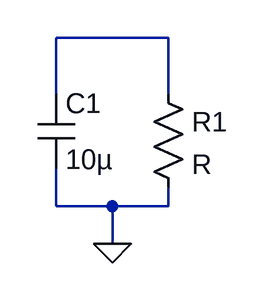
[diagram p0: schematic Draft2.asc]
Draft2.asc, the LTspice schematic file:
Version 4
SHEET 1 880 680
WIRE 240 96 144 96
WIRE 144 144 144 96
WIRE 240 144 240 96
WIRE 144 240 144 208
WIRE 192 240 144 240
WIRE 240 240 240 224
WIRE 240 240 192 240
WIRE 192 272 192 240
FLAG 192 272 0
SYMBOL res 224 128 R0
SYMATTR InstName R1
SYMBOL cap 128 144 R0
SYMATTR InstName C1
SYMATTR Value 10µ

The netlist it stands for:
* Draft2.asc
R1 N001 0 R
C1 N001 0 10µ
.backanno
.end